# Altium project BRFEv1_Shield.PrjPcb
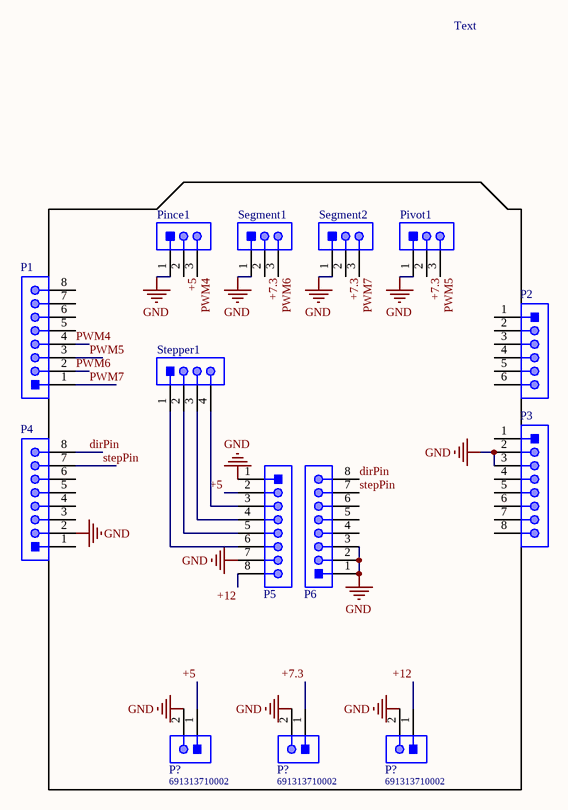
[diagram p0: Sheet1.SchDoc]
1 sheet, 14 parts. Net scope: global (net labels, ports and power ports of the same name join across sheets).
Board file: PCB1.PcbDoc

## Sheet Sheet1.SchDoc
size A4; SheetNumber: 1; SheetTotal: 1

### Parts
(Parts that share a designator on the sheet are numbered #1, #2 ... from top to bottom, then left to right.)
P1  61300811121  [61300811121]  (value not drawn)
P2  61300611121  [61300611121]  (value not drawn)
P3  61300811121  [61300811121]  (value not drawn)
P4  61300811121  [61300811121]  (value not drawn)
P5  61300811121  [61300811121]  (value not drawn)
P6  61300811121  [61300811121]  (value not drawn)
P?#1  691313710002  [691313710002]
P?#2  691313710002  [691313710002]
P?#3  691313710002  [691313710002]
Pince1  71825-3  [TECO-171825-3_V]  (value not drawn)
Pivot1  171825-3  [TECO-171825-3_V]  (value not drawn)
Segment1  171825-3  [TECO-171825-3_V]  (value not drawn)
Segment2  171825-3  [TECO-171825-3_V]  (value not drawn)
Stepper1  61300411121  [61300411121]  (value not drawn)

### Nets
GND: P3.2 P3.3 P4.2 P5.1 P5.7 P6.1 P6.2 P6.3 P?#1.2 P?#2.2 P?#3.2 Pince1.1 Pivot1.1 Segment1.1 Segment2.1
+5: P5.2 P?#1.1 Pince1.2
+7.3: P?#2.1 Pivot1.2 Segment1.2 Segment2.2
+12: P5.8 P?#3.1
dirPin: P4.8 P6.8
PWM4: P1.4 Pince1.3
PWM5: P1.3 Pivot1.3
PWM6: P1.2 Segment1.3
PWM7: P1.1 Segment2.3
stepPin: P4.7 P6.7
NetP5_3: P5.3 Stepper1.4
NetP5_4: P5.4 Stepper1.3
NetP5_5: P5.5 Stepper1.2
NetP5_6: P5.6 Stepper1.1

Not connected (* = marked no-connect by the designer): P1 5 6 7 8; P2 1 2 3 4 5 6; P3 1 4 5 6 7 8; P4 1 3 4 5 6; P6 4 5 6

### Notes on the sheet
- Text

### Library data of the parts
P1 P3-P6 = CMP-1502-01076-1: THT Vertical Pin Header WR-PHD, Pitch 2.54 mm, Single Row, 8 pins; Manufacturer: Wurth Elektronik; Rated Current: 3A; Pin Number: 8; Working Voltage: 250VAC; Gender: Male; Contact Resistance: 20mOhm; Pitch: 2.54mm; Withstanding Voltage: 500VAC; Publisher: WurthElektronik; Operating Temperature: -40to105degC; Orientation: Vertical; Row Number: Single; Part Number: 61300811121; Package Reference: 61300811121; Mounting Technology: THT; Packaging: Bag; Manufacturer URL: http://www.we-online.de; Datasheet URL: https://katalog.we-online.de/em/datasheet/6130xx11121.pdf
P2 = CMP-1502-01070-1: THT Vertical Pin Header WR-PHD, Pitch 2.54 mm, Single Row, 6 pins; Manufacturer: Wurth Elektronik; Gender: Male; Pin Number: 6; Pitch: 2.54mm; Working Voltage: 250VAC; Rated Current: 3A; Withstanding Voltage: 500VAC; Contact Resistance: 20mOhm; Operating Temperature: -40to105degC; Packaging: Bag; Datasheet URL: https://katalog.we-online.de/em/datasheet/6130xx11121.pdf; Package Reference: 61300611121; Mounting Technology: THT; Publisher: WurthElektronik; Part Number: 61300611121; Manufacturer URL: http://www.we-online.de; Row Number: Single; Orientation: Vertical
P?#1-P?#3 = CMP-1502-02048-1: Serie 3137 - 5.00mm Close Horizontal PCB Header WR-TBL, 2 pin; Manufacturer: Wurth Elektronik; Gender: Male; Pin Number: 2; Operating Temperature: -40to105degC; Manufacturer URL: http://www.we-online.de; Mounting Technology: THT; Package Reference: 691313710002; Part Number: 691313710002; Publisher: WurthElektronik; Packaging: Box; Datasheet URL: http://katalog.we-online.de/em/datasheet/6913137100xx.pdf; Pitch: 5.00mm
Pince1 Pivot1 Segment1 Segment2 = CMP-2000-07494-1: Male Header, Pitch 2.5 mm, 1 x 3 Position, Height 10.4 mm, Tail Length 3.6 mm, / -20 to 95 degC / , RoHS, Bulk; Manufacturer: TE Connectivity; Mating Alignment: Yes(With); Tail Length: 0.142inch; Mating Post Length: 7.5mm; PCB Thickness: 0.063inch; PCB Mount Alignment: No(Without); Voltage Rating: 350V; Max Voltage Rating (AC): 250V; Plating Thickness: 0.8um; PCB Mounting Orientation: Vertical; Number of Positions: 3; PCB Mount Retention: Without; Max Current Rating: 3.5A; Max Voltage Rating (DC): 350.25kV; Pitch: 2.5mm; Approvals: UL; Contact Resistance: 20mOhm; Mount: ThroughHole; Length: 7.5mm; Orientation: Straight; Contact Mating Length: 0.295inch; Contact Material: Brass; Housing Material: Nylon; Package Description: Male Header, Pitch 2.5 mm, 1 x 3 Position, Height 10.4 mm, Tail Length 3.6 mm; Colour: Natural; Backwall/Post Interruptions: No(Without); Min Operating Temperature: -20degC; Mating Retention: Yes(With); Connector Type: Header; Packaging: Bag; RoHSCompliant: True; Package Reference: 171825-3; Contact Shape: Square; Strain Relief: No(Without); Contact Gender: Male; Number of Contacts: 3; Manufacturer URL: http://www.te.com/; Height: 0.409inch; Contact Retention: No(Without); Datasheet Version: Rev. Y3, 12/2016; Panel Mount Retention: No(Without); Datasheet URL: http://www.te.com/commerce/DocumentDelivery/DDEController?Action=showdoc&DocId=Customer+Drawing%7F171825%7FY3%7Fpdf%7FEnglish%7FENG_CD_171825_Y3.pdf%7F171825-3; Termination: Solder; Mounting Technology: ThroughHole; Max Operating Temperature: 95degC; Flammability Rating: UL94V-0; REACH SVHC: NoSVHC; Housing Colour: Natural; Package Quantity: 1000; Number of Rows: 1; Depth: 4.9mm; Contact Plating: Tin
Stepper1 = CMP-1502-01064-1: THT Vertical Pin Header WR-PHD, Pitch 2.54 mm, Single Row, 4 pins; Manufacturer: Wurth Elektronik; Withstanding Voltage: 500VAC; Rated Current: 3A; Working Voltage: 250VAC; Pin Number: 4; Gender: Male; Contact Resistance: 20mOhm; Pitch: 2.54mm; Manufacturer URL: http://www.we-online.de; Operating Temperature: -40to105degC; Packaging: Bag; Mounting Technology: THT; Package Reference: 61300411121; Datasheet URL: https://katalog.we-online.de/em/datasheet/6130xx11121.pdf; Publisher: WurthElektronik; Part Number: 61300411121; Row Number: Single; Orientation: Vertical